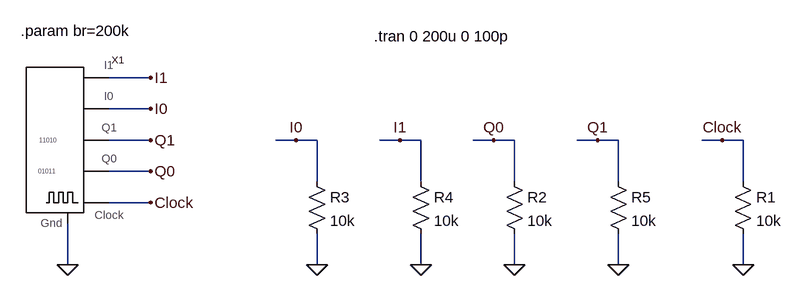
[diagram p0: schematic source_signal_random_NRZ4_test.asc]
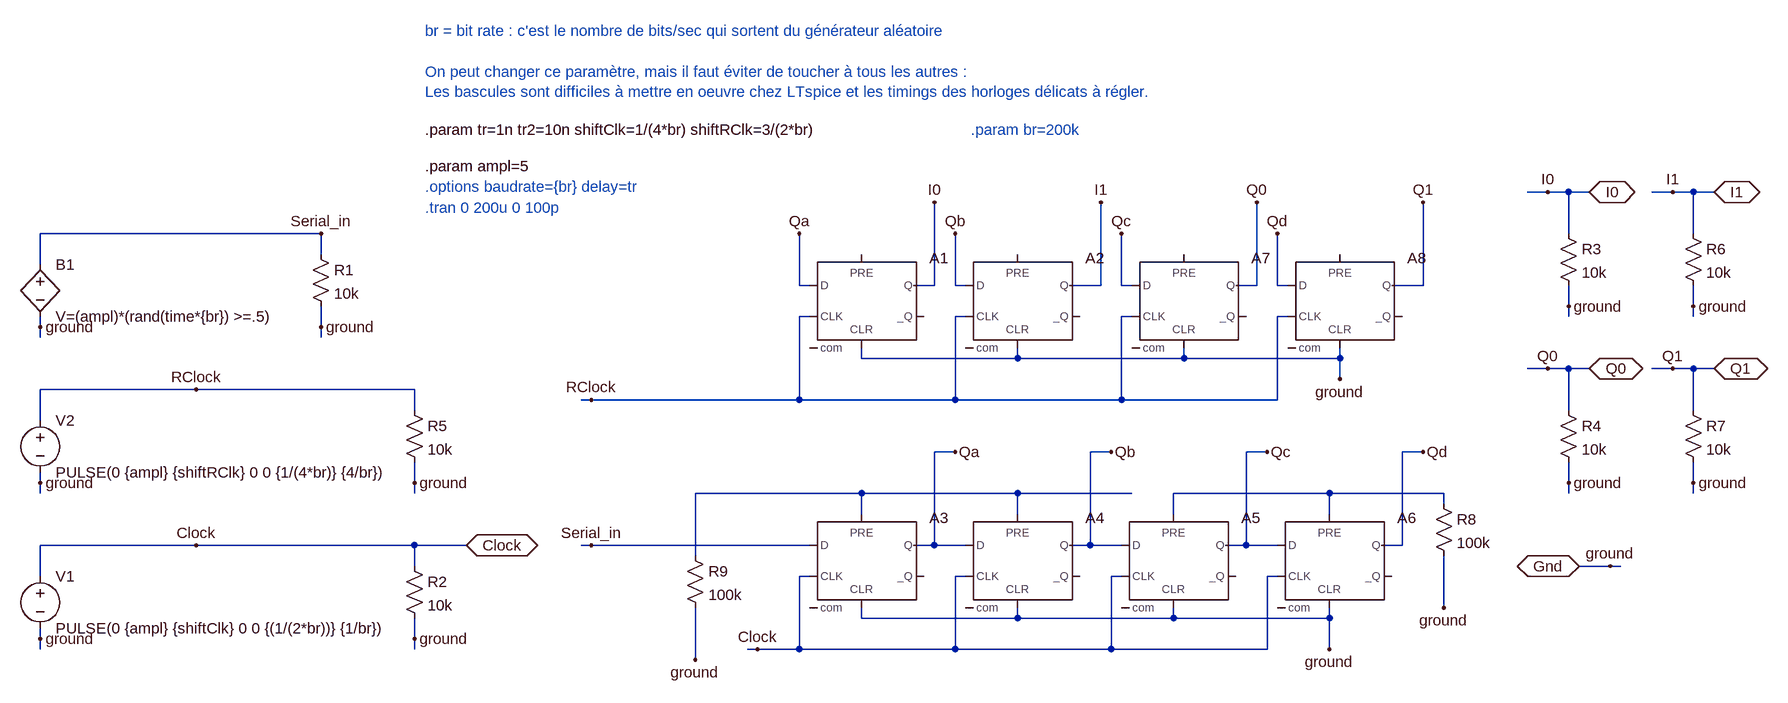
[diagram p1: sub-circuit source_signal_random_nrz4.asc]
source_signal_random_NRZ4_test.asc, the LTspice schematic file:
Version 4
SHEET 1 2032 764
WIRE 352 32 288 32
WIRE 352 80 288 80
WIRE 352 128 288 128
WIRE 576 128 544 128
WIRE 608 128 576 128
WIRE 736 128 704 128
WIRE 768 128 736 128
WIRE 880 128 848 128
WIRE 912 128 880 128
WIRE 1040 128 1008 128
WIRE 1072 128 1040 128
WIRE 1232 128 1200 128
WIRE 1264 128 1232 128
WIRE 352 176 288 176
WIRE 608 192 608 128
WIRE 768 192 768 128
WIRE 912 192 912 128
WIRE 1072 192 1072 128
WIRE 1264 192 1264 128
WIRE 352 224 288 224
WIRE 224 320 224 256
WIRE 608 320 608 272
WIRE 768 320 768 272
WIRE 912 320 912 272
WIRE 1072 320 1072 272
WIRE 1264 320 1264 272
FLAG 608 320 0
FLAG 768 320 0
FLAG 576 128 I0
FLAG 736 128 I1
FLAG 1264 320 0
FLAG 1232 128 Clock
FLAG 352 128 Q1
FLAG 352 176 Q0
FLAG 352 224 Clock
FLAG 224 320 0
FLAG 352 80 I0
FLAG 352 32 I1
FLAG 912 320 0
FLAG 1072 320 0
FLAG 880 128 Q0
FLAG 1040 128 Q1
SYMBOL res 592 176 R0
SYMATTR InstName R3
SYMATTR Value 10k
SYMBOL res 752 176 R0
SYMATTR InstName R4
SYMATTR Value 10k
SYMBOL res 1248 176 R0
SYMATTR InstName R1
SYMATTR Value 10k
SYMBOL source_signal_random_NRZ4 240 192 R0
SYMATTR InstName X1
SYMBOL res 896 176 R0
SYMATTR InstName R2
SYMATTR Value 10k
SYMBOL res 1056 176 R0
SYMATTR InstName R5
SYMATTR Value 10k
TEXT 152 -40 Left 2 !.param br=200k
TEXT 696 -32 Left 2 !.tran 0 200u 0 100p

source_signal_random_nrz4.asc, the sub-circuit schematic file:
Version 4
SHEET 1 2940 1732
WIRE 2592 656 2560 656
WIRE 2624 656 2592 656
WIRE 2656 656 2624 656
WIRE 2784 656 2752 656
WIRE 2816 656 2784 656
WIRE 2848 656 2816 656
WIRE 704 720 272 720
WIRE 2624 720 2624 656
WIRE 2816 720 2816 656
WIRE 704 752 704 720
WIRE 272 768 272 720
WIRE 1440 800 1440 720
WIRE 1456 800 1440 800
WIRE 1648 800 1648 672
WIRE 1648 800 1616 800
WIRE 1680 800 1680 720
WIRE 1696 800 1680 800
WIRE 1904 800 1904 672
WIRE 1904 800 1856 800
WIRE 1936 800 1936 720
WIRE 1952 800 1936 800
WIRE 2144 800 2144 672
WIRE 2144 800 2112 800
WIRE 2176 800 2176 720
WIRE 2192 800 2176 800
WIRE 2400 800 2400 672
WIRE 2400 800 2352 800
WIRE 2624 832 2624 800
WIRE 2816 832 2816 800
WIRE 1456 848 1440 848
WIRE 1696 848 1680 848
WIRE 1952 848 1936 848
WIRE 2192 848 2176 848
WIRE 2624 848 2624 832
WIRE 2816 848 2816 832
WIRE 272 864 272 848
WIRE 704 864 704 832
WIRE 272 880 272 864
WIRE 704 880 704 864
WIRE 1536 912 1536 896
WIRE 1776 912 1776 896
WIRE 1776 912 1536 912
WIRE 2032 912 2032 896
WIRE 2032 912 1776 912
WIRE 2272 912 2272 896
WIRE 2272 912 2032 912
WIRE 2592 928 2560 928
WIRE 2624 928 2592 928
WIRE 2656 928 2624 928
WIRE 2784 928 2752 928
WIRE 2816 928 2784 928
WIRE 2848 928 2816 928
WIRE 2272 944 2272 912
WIRE 512 960 272 960
WIRE 848 960 512 960
WIRE 1120 976 1104 976
WIRE 1440 976 1440 848
WIRE 1440 976 1120 976
WIRE 1680 976 1680 848
WIRE 1680 976 1440 976
WIRE 1936 976 1936 848
WIRE 1936 976 1680 976
WIRE 2176 976 2176 848
WIRE 2176 976 1936 976
WIRE 848 992 848 960
WIRE 2624 992 2624 928
WIRE 2816 992 2816 928
WIRE 272 1008 272 960
WIRE 1680 1056 1648 1056
WIRE 1920 1056 1888 1056
WIRE 2160 1056 2128 1056
WIRE 2400 1056 2368 1056
WIRE 272 1104 272 1088
WIRE 848 1104 848 1072
WIRE 2624 1104 2624 1072
WIRE 2816 1104 2816 1072
WIRE 272 1120 272 1104
WIRE 848 1120 848 1104
WIRE 1536 1120 1280 1120
WIRE 1776 1120 1536 1120
WIRE 1952 1120 1776 1120
WIRE 2256 1120 2016 1120
WIRE 2432 1120 2256 1120
WIRE 2624 1120 2624 1104
WIRE 2816 1120 2816 1104
WIRE 2432 1136 2432 1120
WIRE 1536 1152 1536 1120
WIRE 1776 1152 1776 1120
WIRE 2016 1152 2016 1120
WIRE 2256 1152 2256 1120
WIRE 512 1200 272 1200
WIRE 848 1200 512 1200
WIRE 928 1200 848 1200
WIRE 1120 1200 1104 1200
WIRE 1456 1200 1120 1200
WIRE 1648 1200 1648 1056
WIRE 1648 1200 1616 1200
WIRE 1696 1200 1648 1200
WIRE 1888 1200 1888 1056
WIRE 1888 1200 1856 1200
WIRE 1936 1200 1888 1200
WIRE 2128 1200 2128 1056
WIRE 2128 1200 2096 1200
WIRE 2176 1200 2128 1200
WIRE 2368 1200 2368 1056
WIRE 2368 1200 2336 1200
WIRE 1280 1216 1280 1120
WIRE 848 1232 848 1200
WIRE 2688 1232 2640 1232
WIRE 2704 1232 2688 1232
WIRE 272 1248 272 1200
WIRE 1456 1248 1440 1248
WIRE 1696 1248 1680 1248
WIRE 1936 1248 1920 1248
WIRE 2176 1248 2160 1248
WIRE 2432 1296 2432 1216
WIRE 1536 1312 1536 1296
WIRE 1776 1312 1776 1296
WIRE 1776 1312 1536 1312
WIRE 2016 1312 2016 1296
WIRE 2016 1312 1776 1312
WIRE 2256 1312 2256 1296
WIRE 2256 1312 2016 1312
WIRE 272 1344 272 1328
WIRE 848 1344 848 1312
WIRE 272 1360 272 1344
WIRE 848 1360 848 1344
WIRE 1376 1360 1360 1360
WIRE 1440 1360 1440 1248
WIRE 1440 1360 1376 1360
WIRE 1680 1360 1680 1248
WIRE 1680 1360 1440 1360
WIRE 1920 1360 1920 1248
WIRE 1920 1360 1680 1360
WIRE 2160 1360 2160 1248
WIRE 2160 1360 1920 1360
WIRE 2256 1360 2256 1312
WIRE 1280 1376 1280 1296
FLAG 928 1200 Clock
IOPIN 928 1200 BiDir
FLAG 2656 928 Q0
IOPIN 2656 928 BiDir
FLAG 2656 656 I0
IOPIN 2656 656 BiDir
FLAG 2640 1232 Gnd
IOPIN 2640 1232 BiDir
FLAG 704 720 Serial_in
FLAG 1120 1200 Serial_in
FLAG 1680 1056 Qa
FLAG 1920 1056 Qb
FLAG 1376 1360 Clock
FLAG 1440 720 Qa
FLAG 1680 720 Qb
FLAG 1648 672 I0
FLAG 1904 672 I1
FLAG 2592 656 I0
FLAG 2592 928 Q0
FLAG 512 1200 Clock
FLAG 512 960 RClock
FLAG 1120 976 RClock
FLAG 2256 1360 ground
FLAG 848 1104 ground
FLAG 848 1344 ground
FLAG 704 864 ground
FLAG 2624 832 ground
FLAG 2624 1104 ground
FLAG 272 864 ground
FLAG 272 1104 ground
FLAG 272 1344 ground
FLAG 2688 1232 ground
FLAG 2848 928 Q1
IOPIN 2848 928 BiDir
FLAG 2848 656 I1
IOPIN 2848 656 BiDir
FLAG 2784 656 I1
FLAG 2784 928 Q1
FLAG 2816 832 ground
FLAG 2816 1104 ground
FLAG 2160 1056 Qc
FLAG 2400 1056 Qd
FLAG 1936 720 Qc
FLAG 2176 720 Qd
FLAG 2144 672 Q0
FLAG 2400 672 Q1
FLAG 2272 944 ground
FLAG 2432 1296 ground
FLAG 1280 1376 ground
SYMBOL bv 272 752 R0
SYMATTR InstName B1
SYMATTR Value V=(ampl)*(rand(time*{br}) >=.5)
SYMBOL res 688 736 R0
SYMATTR InstName R1
SYMATTR Value 10k
SYMBOL voltage 272 1232 R0
WINDOW 123 0 0 Left 2
WINDOW 39 0 0 Left 2
SYMATTR InstName V1
SYMATTR Value PULSE(0 {ampl} {shiftClk} 0 0 {(1/(2*br))} {1/br})
SYMBOL res 832 1216 R0
SYMATTR InstName R2
SYMATTR Value 10k
SYMBOL Digital\\dflop 1536 752 R0
SYMATTR InstName A1
SYMATTR Value2 Vhigh={ampl} Trise={tr2} Td={tr2}
SYMBOL Digital\\dflop 1776 752 R0
SYMATTR InstName A2
SYMATTR Value2 Vhigh={ampl} Trise={tr2} Td={tr2}
SYMBOL Digital\\dflop 1536 1152 R0
SYMATTR InstName A3
SYMATTR SpiceLine Vhigh={ampl} Trise={tr2} Td={tr2}
SYMBOL Digital\\dflop 1776 1152 R0
SYMATTR InstName A4
SYMATTR Value2 Vhigh={ampl} Trise={tr2} Td={tr2}
SYMBOL res 2608 704 R0
SYMATTR InstName R3
SYMATTR Value 10k
SYMBOL res 2608 976 R0
SYMATTR InstName R4
SYMATTR Value 10k
SYMBOL voltage 272 992 R0
WINDOW 123 0 0 Left 2
WINDOW 39 0 0 Left 2
SYMATTR InstName V2
SYMATTR Value PULSE(0 {ampl} {shiftRClk} 0 0 {1/(4*br)} {4/br})
SYMBOL res 832 976 R0
SYMATTR InstName R5
SYMATTR Value 10k
SYMBOL res 2800 704 R0
SYMATTR InstName R6
SYMATTR Value 10k
SYMBOL res 2800 976 R0
SYMATTR InstName R7
SYMATTR Value 10k
SYMBOL Digital\\dflop 2016 1152 R0
SYMATTR InstName A5
SYMATTR SpiceLine Vhigh={ampl} Trise={tr2} Td={tr2}
SYMBOL Digital\\dflop 2256 1152 R0
SYMATTR InstName A6
SYMATTR Value2 Vhigh={ampl} Trise={tr2} Td={tr2}
SYMBOL Digital\\dflop 2032 752 R0
SYMATTR InstName A7
SYMATTR Value2 Vhigh={ampl} Trise={tr2} Td={tr2}
SYMBOL Digital\\dflop 2272 752 R0
SYMATTR InstName A8
SYMATTR Value2 Vhigh={ampl} Trise={tr2} Td={tr2}
SYMBOL res 2416 1120 R0
SYMATTR InstName R8
SYMATTR Value 100k
SYMBOL res 1264 1200 R0
SYMATTR InstName R9
SYMATTR Value 100k
TEXT 864 408 Left 2 ;br = bit rate : c'est le nombre de bits/sec qui sortent du générateur aléatoire\n \nOn peut changer ce paramètre, mais il faut éviter de toucher à tous les autres :\nLes bascules sont difficiles à mettre en oeuvre chez LTspice et les timings des horloges délicats à régler.
TEXT 1704 560 Left 2 ;.param br=200k
TEXT 864 616 Left 2 !.param ampl=5
TEXT 864 648 Left 2 ;.options baudrate={br} delay=tr
TEXT 864 680 Left 2 ;.tran 0 200u 0 100p
TEXT 864 560 Left 2 !.param tr=1n tr2=10n shiftClk=1/(4*br) shiftRClk=3/(2*br)

The netlist it stands for:
* source_signal_random_NRZ4_test.asc
R3 I0 0 10k
R4 I1 0 10k
R1 Clock 0 10k
XX1 0 Clock Q0 Q1 I0 I1 source_signal_random_nrz4
R2 Q0 0 10k
R5 Q1 0 10k

* block symbol definitions
.subckt source_signal_random_nrz4 Gnd Clock Q0 Q1 I0 I1
B1 Serial_in Gnd V=(ampl)*(rand(time*{br}) >=.5)
R1 Serial_in Gnd 10k
V1 Clock Gnd PULSE(0 {ampl} {shiftClk} 0 0 {(1/(2*br))} {1/br})
R2 Clock Gnd 10k
A1 Qa 0 RClock 0 Gnd 0 I0 0 DFLOP Vhigh={ampl} Trise={tr2} Td={tr2}
A2 Qb 0 RClock 0 Gnd 0 I1 0 DFLOP Vhigh={ampl} Trise={tr2} Td={tr2}
A3 Serial_in 0 Clock N001 Gnd 0 Qa 0 DFLOP Vhigh={ampl} Trise={tr2} Td={tr2}
A4 Qa 0 Clock N001 Gnd 0 Qb 0 DFLOP Vhigh={ampl} Trise={tr2} Td={tr2}
R3 I0 Gnd 10k
R4 Q0 Gnd 10k
V2 RClock Gnd PULSE(0 {ampl} {shiftRClk} 0 0 {1/(4*br)} {4/br})
R5 RClock Gnd 10k
R6 I1 Gnd 10k
R7 Q1 Gnd 10k
A5 Qb 0 Clock N002 Gnd 0 Qc 0 DFLOP Vhigh={ampl} Trise={tr2} Td={tr2}
A6 Qc 0 Clock N002 Gnd 0 Qd 0 DFLOP Vhigh={ampl} Trise={tr2} Td={tr2}
A7 Qc 0 RClock 0 Gnd 0 Q0 0 DFLOP Vhigh={ampl} Trise={tr2} Td={tr2}
A8 Qd 0 RClock 0 Gnd 0 Q1 0 DFLOP Vhigh={ampl} Trise={tr2} Td={tr2}
R8 N002 Gnd 100k
R9 N001 Gnd 100k
* br = bit rate : c'est le nombre de bits/sec qui sortent du générateur aléatoire
* On peut changer ce paramètre, mais il faut éviter de toucher à tous les autres :
* Les bascules sont difficiles à mettre en oeuvre chez LTspice et les timings des horloges délicats à régler.
* .param br=200k
.param ampl=5
* .options baudrate={br} delay=tr
* .tran 0 200u 0 100p
.param tr=1n tr2=10n shiftClk=1/(4*br) shiftRClk=3/(2*br)
.ends source_signal_random_nrz4

.param br=200k
.tran 0 200u 0 100p
.backanno
.end